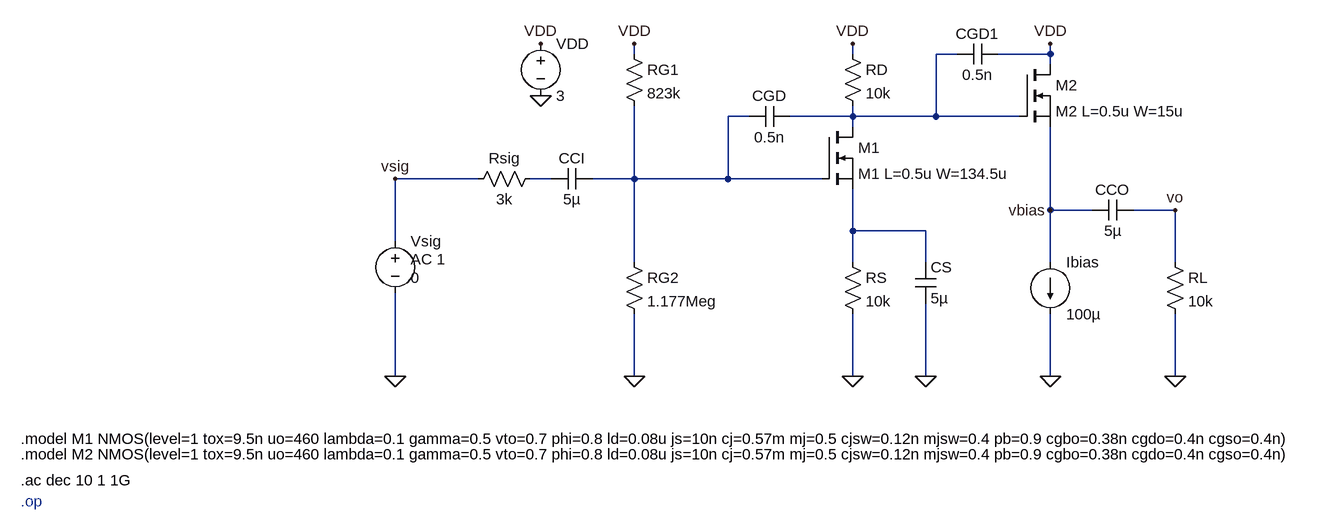
[diagram p0: schematic hw3_112021117_f2.asc]
hw3_112021117_f2.asc, the LTspice schematic file:
Version 4.1
SHEET 1 1708 680
WIRE 352 -176 352 -192
WIRE 688 -176 688 -192
WIRE 848 -176 816 -176
WIRE 992 -176 992 -192
WIRE 992 -176 912 -176
WIRE 992 -160 992 -176
WIRE 528 -80 496 -80
WIRE 688 -80 688 -96
WIRE 688 -80 592 -80
WIRE 816 -80 816 -176
WIRE 816 -80 688 -80
WIRE 944 -80 816 -80
WIRE 688 -64 688 -80
WIRE 112 16 -16 16
WIRE 224 16 192 16
WIRE 352 16 352 -96
WIRE 352 16 288 16
WIRE 496 16 496 -80
WIRE 496 16 352 16
WIRE 640 16 496 16
WIRE 992 64 992 -64
WIRE 1056 64 992 64
WIRE 1184 64 1120 64
WIRE 688 96 688 32
WIRE 800 96 688 96
WIRE -16 112 -16 16
WIRE 352 144 352 16
WIRE 688 144 688 96
WIRE 800 144 800 96
WIRE 992 144 992 64
WIRE 1184 144 1184 64
WIRE -16 320 -16 192
WIRE 352 320 352 224
WIRE 688 320 688 224
WIRE 800 320 800 208
WIRE 992 320 992 224
WIRE 1184 320 1184 224
FLAG -16 320 0
FLAG 352 320 0
FLAG 688 320 0
FLAG 800 320 0
FLAG 1184 320 0
FLAG 992 320 0
FLAG 208 -112 0
FLAG 352 -192 VDD
FLAG 688 -192 VDD
FLAG 992 -192 VDD
FLAG 208 -192 VDD
FLAG -16 16 vsig
FLAG 1184 64 vo
FLAG 992 64 vbias
SYMBOL voltage -16 96 R0
WINDOW 123 24 44 Left 2
WINDOW 39 0 0 Left 0
WINDOW 3 24 72 Left 2
SYMATTR Value2 AC 1
SYMATTR Value 0
SYMATTR InstName Vsig
SYMBOL res 208 0 R90
WINDOW 0 0 56 VBottom 2
WINDOW 3 32 56 VTop 2
SYMATTR InstName Rsig
SYMATTR Value 3k
SYMBOL cap 288 0 R90
WINDOW 0 0 32 VBottom 2
WINDOW 3 32 32 VTop 2
SYMATTR InstName CCI
SYMATTR Value 5µ
SYMBOL res 336 -192 R0
SYMATTR InstName RG1
SYMATTR Value 823k
SYMBOL res 336 128 R0
SYMATTR InstName RG2
SYMATTR Value 1.177Meg
SYMBOL nmos 640 -64 R0
SYMATTR InstName M1
SYMATTR Value M1 L=0.5u W=134.5u
SYMBOL res 672 128 R0
SYMATTR InstName RS
SYMATTR Value 10k
SYMBOL cap 784 144 R0
SYMATTR InstName CS
SYMATTR Value 5µ
SYMBOL res 672 -192 R0
SYMATTR InstName RD
SYMATTR Value 10k
SYMBOL nmos 944 -160 R0
SYMATTR InstName M2
SYMATTR Value M2 L=0.5u W=15u
SYMBOL cap 1120 48 R90
WINDOW 0 0 32 VBottom 2
WINDOW 3 32 32 VTop 2
SYMATTR InstName CCO
SYMATTR Value 5µ
SYMBOL res 1168 128 R0
SYMATTR InstName RL
SYMATTR Value 10k
SYMBOL current 992 144 R0
WINDOW 123 0 0 Left 0
WINDOW 39 0 0 Left 0
SYMATTR InstName Ibias
SYMATTR Value 100µ
SYMBOL voltage 208 -208 R0
SYMATTR InstName VDD
SYMATTR Value 3
SYMBOL cap 592 -96 R90
WINDOW 0 0 32 VBottom 2
WINDOW 3 32 32 VTop 2
SYMATTR InstName CGD
SYMATTR Value 0.5n
SYMBOL cap 912 -192 R90
WINDOW 0 0 32 VBottom 2
WINDOW 3 32 32 VTop 2
SYMATTR InstName CGD1
SYMATTR Value 0.5n
TEXT -592 416 Left 2 !.model M1 NMOS(level=1 tox=9.5n uo=460 lambda=0.1 gamma=0.5 vto=0.7 phi=0.8 ld=0.08u js=10n cj=0.57m mj=0.5 cjsw=0.12n mjsw=0.4 pb=0.9 cgbo=0.38n cgdo=0.4n cgso=0.4n)
TEXT -592 440 Left 2 !.model M2 NMOS(level=1 tox=9.5n uo=460 lambda=0.1 gamma=0.5 vto=0.7 phi=0.8 ld=0.08u js=10n cj=0.57m mj=0.5 cjsw=0.12n mjsw=0.4 pb=0.9 cgbo=0.38n cgdo=0.4n cgso=0.4n)
TEXT -592 480 Left 2 !.ac dec 10 1 1G
TEXT -592 512 Left 2 ;.op

The netlist it stands for:
* hw3_112021117_f2.asc
Vsig vsig 0 0 AC 1
Rsig N003 vsig 3k
CCI N002 N003 5µ
RG1 VDD N002 823k
RG2 N002 0 1.177Meg
M1 N001 N002 N004 N004 M1 L=0.5u W=134.5u
RS N004 0 10k
CS N004 0 5µ
RD VDD N001 10k
M2 VDD N001 vbias vbias M2 L=0.5u W=15u
CCO vo vbias 5µ
RL vo 0 10k
Ibias vbias 0 100µ
VDD VDD 0 3
CGD N001 N002 0.5n
CGD1 VDD N001 0.5n
.model NMOS NMOS
.model PMOS PMOS
.lib standard.mos
.model M1 NMOS(level=1 tox=9.5n uo=460 lambda=0.1 gamma=0.5 vto=0.7 phi=0.8 ld=0.08u js=10n cj=0.57m mj=0.5 cjsw=0.12n mjsw=0.4 pb=0.9 cgbo=0.38n cgdo=0.4n cgso=0.4n)
.model M2 NMOS(level=1 tox=9.5n uo=460 lambda=0.1 gamma=0.5 vto=0.7 phi=0.8 ld=0.08u js=10n cj=0.57m mj=0.5 cjsw=0.12n mjsw=0.4 pb=0.9 cgbo=0.38n cgdo=0.4n cgso=0.4n)
.ac dec 10 1 1G
* .op
.backanno
.end